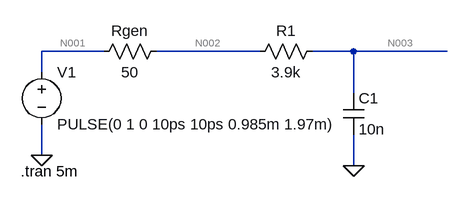
[diagram p0: schematic RC-circuit.asc]
RC-circuit.asc, the LTspice schematic file:
Version 4
SHEET 1 880 680
WIRE -112 96 -208 96
WIRE 128 96 -32 96
WIRE 272 96 208 96
WIRE 416 96 272 96
WIRE -208 128 -208 96
WIRE 272 160 272 96
WIRE -208 256 -208 208
WIRE 272 272 272 224
FLAG 272 272 0
FLAG -208 256 0
SYMBOL voltage -208 112 R0
WINDOW 123 0 0 Left 2
WINDOW 39 0 0 Left 2
SYMATTR InstName V1
SYMATTR Value PULSE(0 1 0 10ps 10ps 0.985m 1.97m)
SYMBOL res 224 80 R90
WINDOW 0 0 56 VBottom 2
WINDOW 3 32 56 VTop 2
SYMATTR InstName R1
SYMATTR Value 3.9k
SYMBOL cap 256 160 R0
SYMATTR InstName C1
SYMATTR Value 10n
SYMBOL res -16 80 R90
WINDOW 0 0 56 VBottom 2
WINDOW 3 32 56 VTop 2
SYMATTR InstName Rgen
SYMATTR Value 50
TEXT -240 280 Left 2 !.tran 5m

The netlist it stands for:
* RC-circuit.asc
V1 N001 0 PULSE(0 1 0 10ps 10ps 0.985m 1.97m)
R1 N003 N002 3.9k
C1 N003 0 10n
Rgen N002 N001 50
.tran 5m
.backanno
.end

* Results of the author's LTspice run, read from the files saved beside the schematic
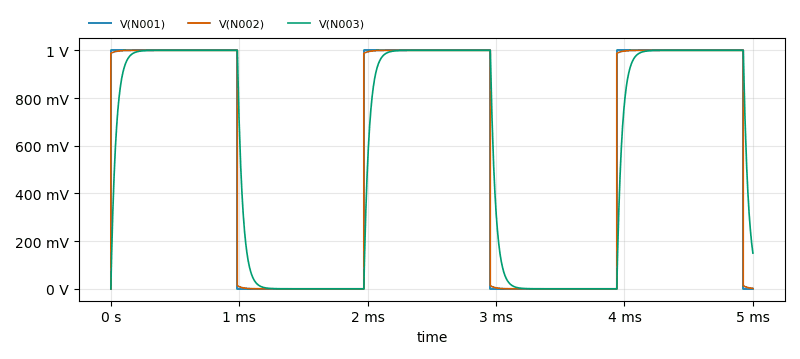
[diagram p1: Transient Analysis of RC-circuit.asc, plotted from the saved traces]
* Transient Analysis, 1 run:
*   V(N001): min 0 V, max 1 V, average 591 mV, rms 768.8 mV, last 0 V
*   V(N002): min 0 V, max 1 V, average 591 mV, rms 768.4 mV, last 1.891 mV
*   V(N003): min 0 V, max 1 V, average 589.9 mV, rms 753.4 mV, last 149.4 mV